# Altium schematic sheet tracker_main.SchDoc
size 431 x 279 mm; SheetNumber: 1; SheetTotal: 2
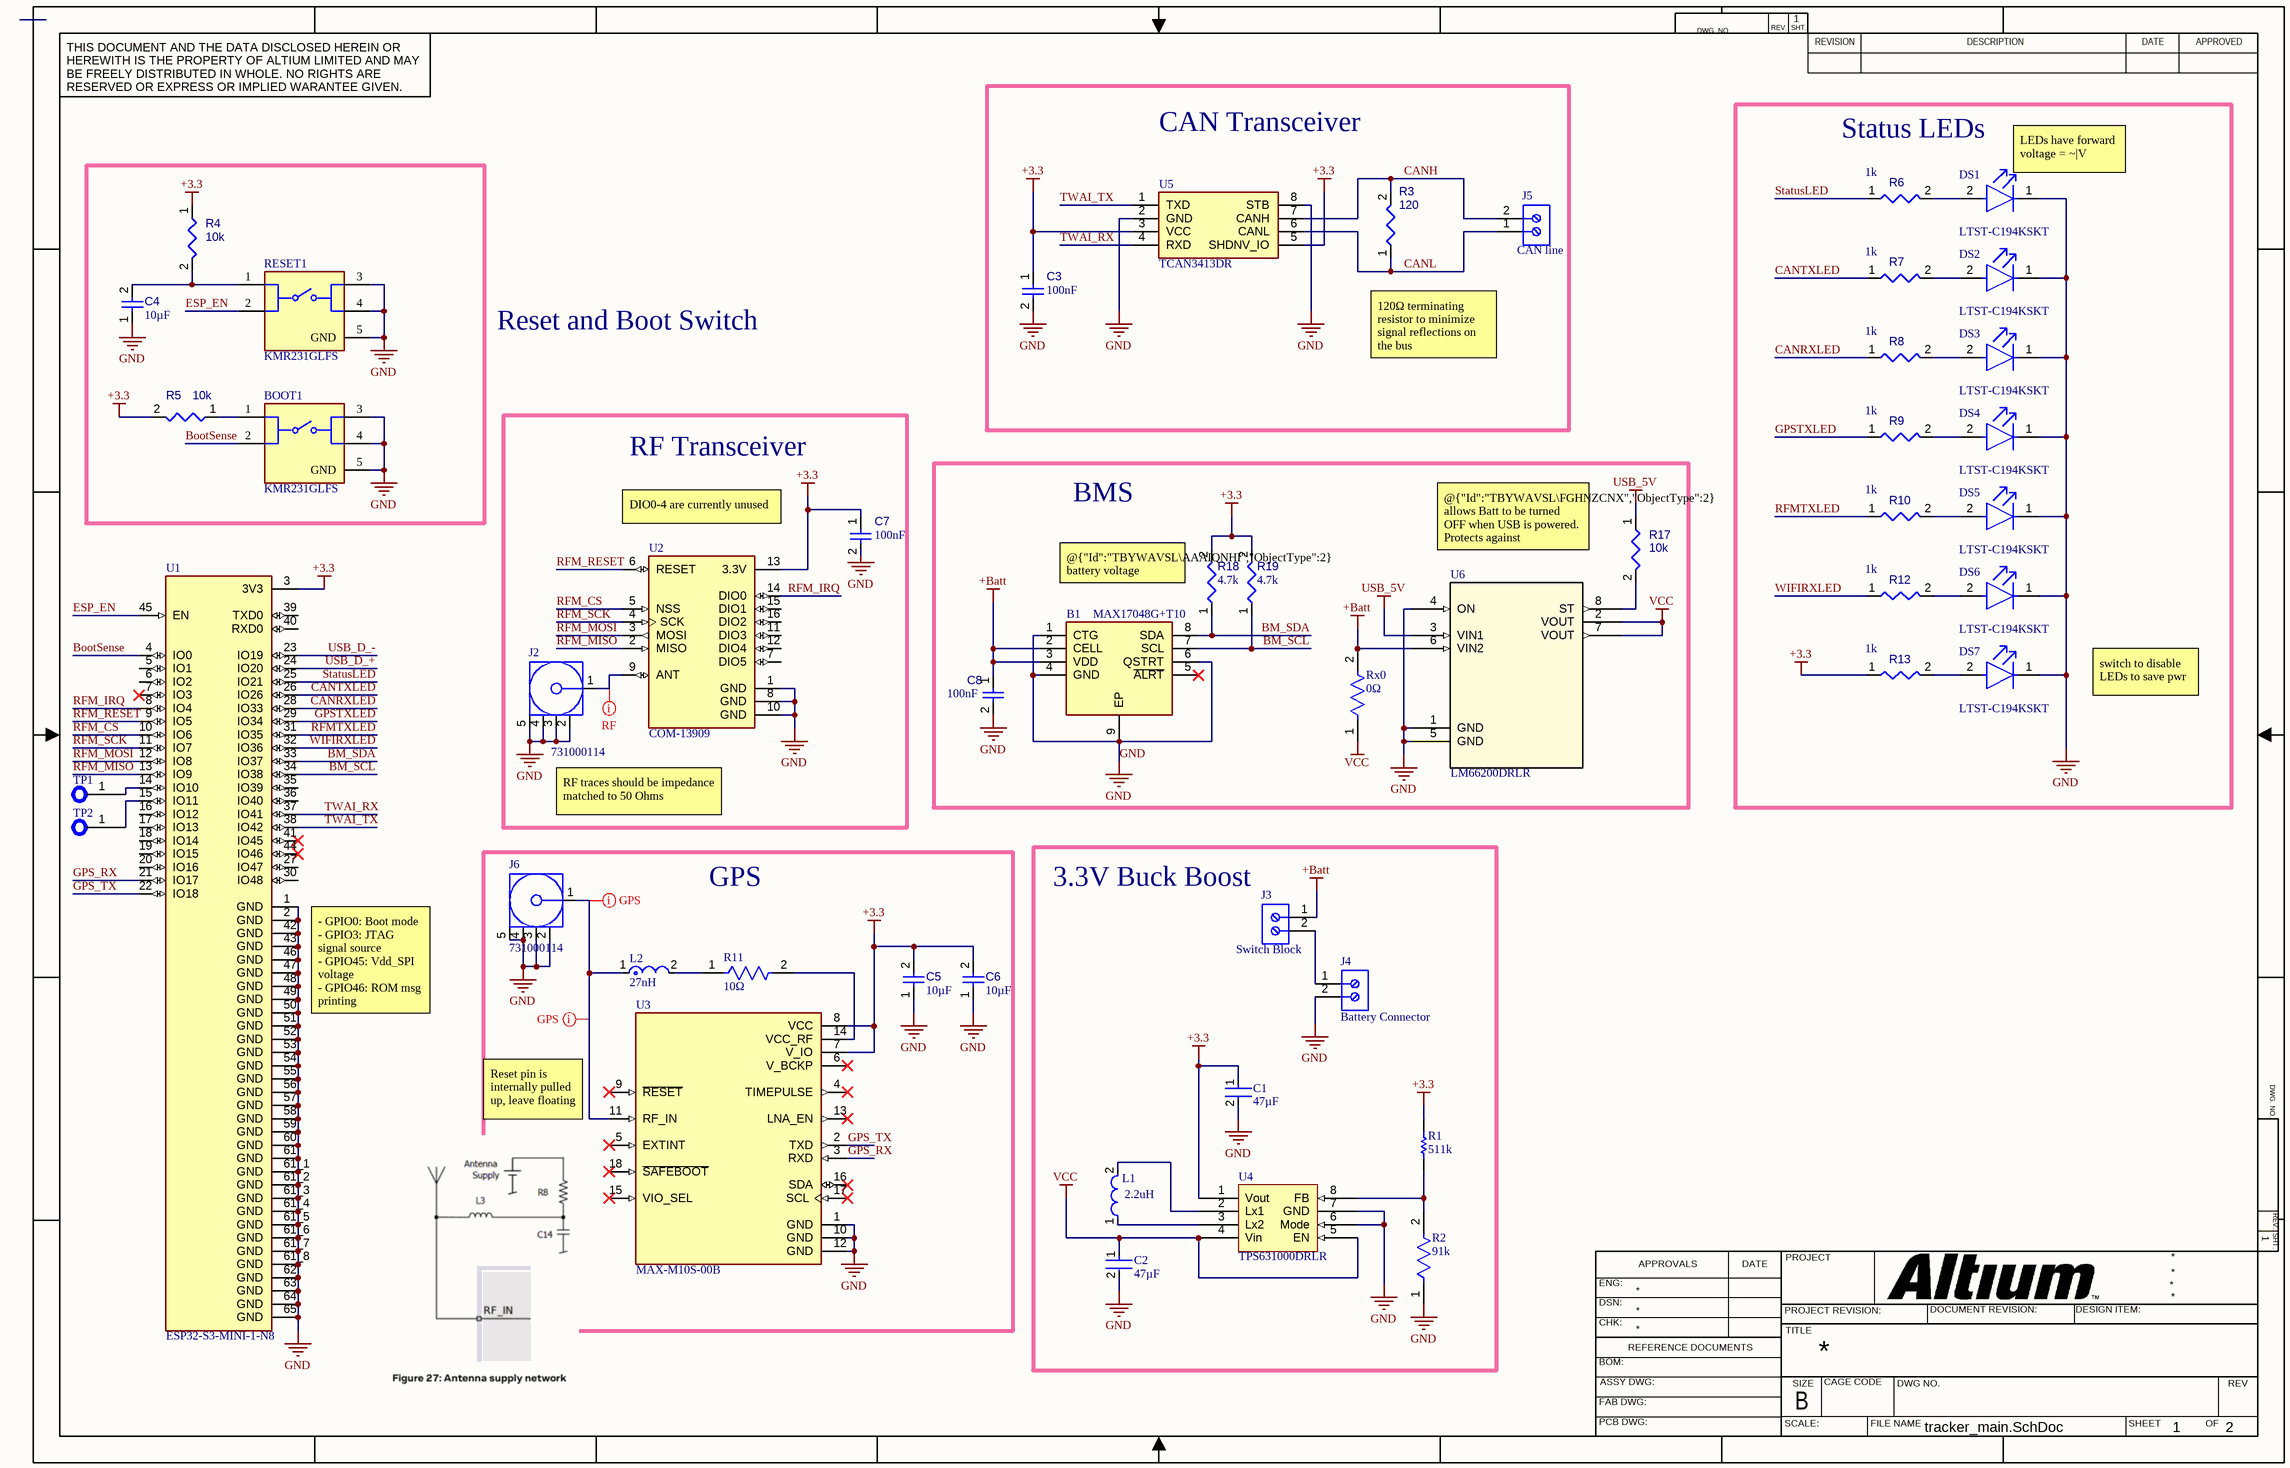
[diagram p0: tracker_main.SchDoc]

## Parts
B1  MAX17048G+T10  [SON50P200X200X80-9N-D]
BOOT1  KMR231GLFS  [FP-KMR231GLFS-MFG]
C1  47µF  [FP-0603-L_1_6_0_2-W_0_8_0-MFG]
C2  47µF  [FP-0603-L_1_6_0_2-W_0_8_0-MFG]
C3  100nF  [CAPC1608X90X40NL10T20]
C4  value 10µF  [CAPC0603(1608)100_L]  (hidden comment: Capacitor 10µF +/-20% 10V 0603)
C5  value 10µF  [CAPC0603(1608)100_L]  (hidden comment: Capacitor 10µF +/-20% 10V 0603)
C6  value 10µF  [CAPC0603(1608)100_L]  (hidden comment: Capacitor 10µF +/-20% 10V 0603)
C7  100nF  [CAPC1608X90X40NL10T20]
C8  100nF  [CAPC1608X90X40NL10T20]
DS1  LTST-C194KSKT  [FP-LTST-C194KSKT-MFG]
DS2  LTST-C194KSKT  [FP-LTST-C194KSKT-MFG]
DS3  LTST-C194KSKT  [FP-LTST-C194KSKT-MFG]
DS4  LTST-C194KSKT  [FP-LTST-C194KSKT-MFG]
DS5  LTST-C194KSKT  [FP-LTST-C194KSKT-MFG]
DS6  LTST-C194KSKT  [FP-LTST-C194KSKT-MFG]
DS7  LTST-C194KSKT  [FP-LTST-C194KSKT-MFG]
J2  731000114  [MOLX-731000114_V]
J3  Switch Block  [PHOE-1725656-2]
J4  Battery Connector  [PHOE-1725656-2]
J5  CAN line  [PHOE-1725656-2]
J6  731000114  [MOLX-731000114_V]
L1  value 2.2uH  [FP-DFE21CC_EL-MFG]  (hidden comment: DFE21CCN2R2MELL)
L2  27nH  [FP-LQG18HH_00-IPC_C]
R1  511k  [RESC1609X50X30NL10T20]
R2  91k  [FP-CRCW0603-HPe3-IPC_B]
R3  120  [RESC0603(1608)_L]
R4  10k  [RESC1608X55X25ML10T15]
R5  10k  [RESC1608X55X25ML10T15]
R6  value 1k  [RESC1608X55X25ML10T15]  (hidden comment: Resistor 1k +/-1% 0603 100 mW)
R7  value 1k  [RESC1608X55X25ML10T15]  (hidden comment: Resistor 1k +/-1% 0603 100 mW)
R8  value 1k  [RESC1608X55X25ML10T15]  (hidden comment: Resistor 1k +/-1% 0603 100 mW)
R9  value 1k  [RESC1608X55X25ML10T15]  (hidden comment: Resistor 1k +/-1% 0603 100 mW)
R10  value 1k  [RESC1608X55X25ML10T15]  (hidden comment: Resistor 1k +/-1% 0603 100 mW)
R11  10Ω  [FP-RNCF0603-MFG]
R12  value 1k  [RESC1608X55X25ML10T15]  (hidden comment: Resistor 1k +/-1% 0603 100 mW)
R13  value 1k  [RESC1608X55X25ML10T15]  (hidden comment: Resistor 1k +/-1% 0603 100 mW)
R17  10k  [RESC1608X55X25ML10T15]
R18  value 4.7k  [RESC1608X55X25ML10T15]  (hidden comment: Resistor 4k7 +/-1% 0603 100 mW)
R19  value 4.7k  [RESC1608X55X25ML10T15]  (hidden comment: Resistor 4k7 +/-1% 0603 100 mW)
RESET1  KMR231GLFS  [FP-KMR231GLFS-MFG]
Rx0  0Ω  [FP-HCJ0805-MFG]
TP1  TP_1  [Testpoint1]  (value not drawn)  (no BOM)
TP2  TP_1  [Testpoint1]  (value not drawn)  (no BOM)
U1  ESP32-S3-MINI-1-N8  [XCVR_ESP32-S3-MINI-1-N8]
U2  COM-13909  [MOD_COM-13909]
U3  MAX-M10S-00B  [XCVR_MAX-M10S-00B]
U4  TPS631000DRLR  [SON50P120X60-8N]
U5  TCAN3413DR  [SOIC127P600X175-8N]
U6  LM66200DRLR  [SOT-5X3_DRL_TEX]

## Blocks framed on the sheet
CAN Transceiver: C3 J5 R3 U5
Status LEDs: DS1-DS7 R6-R10 R12 R13
RF Transceiver: C7 J2 U2
BMS: B1 C8 R17-R19 Rx0 U6
GPS: C5 C6 J6 L2 R11 U3
3.3V Buck Boost: C1 C2 J3 J4 L1 R1 R2 U4

## Nets
+3.3: C1.1 C3.1 C5.2 C6.2 C7.1 R1.2 R4.1 R5.2 R13.1 R18.2 R19.2 U1.3(3V3) U2.13(3.3V) U3.7(V_IO) U3.8(VCC) U4.1(Vout) U5.3(VCC) U5.5(SHDNV_IO)
+Batt: B1.2(CELL) B1.3(VDD) C8.1 J3.1 Rx0.2 U6.6(VIN2)
GND: B1.1(CTG) B1.4(GND) B1.6(QSTRT) B1.9(EP) BOOT1.3 BOOT1.4 BOOT1.5(GND) C1.2 C2.2 C3.2 C4.1 C5.1 C6.1 C7.2 C8.2 DS1.1(C) DS2.1(C) DS3.1(C) DS4.1(C) DS5.1(C) DS6.1(C) DS7.1(C) J2.2 J2.3 J2.4 J2.5 J4.2 J6.2 J6.3 J6.4 J6.5 R2.1 RESET1.3 RESET1.4 RESET1.5(GND) U1.1(GND) U1.2(GND) U1.42(GND) U1.43(GND) U1.46(GND) U1.47(GND) U1.48(GND) U1.49(GND) U1.50(GND) U1.51(GND) U1.52(GND) U1.53(GND) U1.54(GND) U1.55(GND) U1.56(GND) U1.57(GND) U1.58(GND) U1.59(GND) U1.60(GND) U1.61(GND) U1.61_1(GND) U1.61_2(GND) U1.61_3(GND) U1.61_4(GND) U1.61_5(GND) U1.61_6(GND) U1.61_7(GND) U1.61_8(GND) U1.62(GND) U1.63(GND) U1.64(GND) U1.65(GND) U2.1(GND) U2.8(GND) U2.10(GND) U3.1(GND) U3.10(GND) U3.12(GND) U4.6(Mode) U4.7(GND) U5.2(GND) U5.8(STB) U6.1(GND) U6.4(ON) U6.5(GND)
USB_5V: R17.1 U6.3(VIN1)
VCC: C2.1 Rx0.1 U4.4(Vin) U4.5(EN) U6.2(VOUT) U6.7(VOUT)
BM_SCL: B1.7(SCL) R19.1 U1.34(IO38)
BM_SDA: B1.8(SDA) R18.1 U1.33(IO37)
BootSense: BOOT1.2 U1.4(IO0)
CANH: J5.2 R3.2 U5.7(CANH)
CANL: J5.1 R3.1 U5.6(CANL)
CANRXLED: R8.1 U1.28(IO33)
CANTXLED: R7.1 U1.26(IO26)
ESP_EN: RESET1.2 U1.45(EN)
GPS_RX: U1.21(IO17) U3.3(RXD)
GPS_TX: U1.22(IO18) U3.2(TXD)
GPSTXLED: R9.1 U1.29(IO34)
RFM_CS: U1.10(IO6) U2.5(NSS)
RFM_IRQ: U1.8(IO4) U2.14(DIO0)
RFM_MISO: U1.13(IO9) U2.2(MISO)
RFM_MOSI: U1.12(IO8) U2.3(MOSI)
RFM_RESET: U1.9(IO5) U2.6(RESET)
RFM_SCK: U1.11(IO7) U2.4(SCK)
RFMTXLED: R10.1 U1.31(IO35)
StatusLED: R6.1 U1.25(IO21)
TWAI_RX: U1.37(IO41) U5.4(RXD)
TWAI_TX: U1.38(IO42) U5.1(TXD)
USB_D_+: U1.24(IO20)
USB_D_-: U1.23(IO19)
WIFIRXLED: R12.1 U1.32(IO36)
NetBOOT1_1: BOOT1.1 R5.1
NetC4_2: C4.2 R4.2 RESET1.1
NetDS1_2: DS1.2(A) R6.2
NetDS2_2: DS2.2(A) R7.2
NetDS3_2: DS3.2(A) R8.2
NetDS4_2: DS4.2(A) R9.2
NetDS5_2: DS5.2(A) R10.2
NetDS6_2: DS6.2(A) R12.2
NetDS7_2: DS7.2(A) R13.2
NetJ2_1: J2.1 U2.9(ANT)
NetJ3_2: J3.2 J4.1
NetJ6_1: J6.1 L2.1 U3.11(RF_IN)
NetL1_1: L1.1 U4.3(Lx2)
NetL1_2: L1.2 U4.2(Lx1)
NetL2_2: L2.2 R11.1
NetR1_1: R1.1 R2.2 U4.8(FB)
NetR11_2: R11.2 U3.14(VCC_RF)
NetR17_2: R17.2 U6.8(ST)
NetTP1_1: TP1.1 U1.14(IO10)
NetTP2_1: TP2.1 U1.15(IO11)

Not connected (* = marked no-connect by the designer): B1 5(~{ALRT})*; U1 5(IO1) 6(IO2) 7(IO3)* 16(IO12) 17(IO13) 18(IO14) 19(IO15) 20(IO16) 27(IO47) 30(IO48) 35(IO39) 36(IO40) 39(TXD0) 40(RXD0) 41(IO45)* 44(IO46)*; U2 7(DIO5) 11(DIO3) 12(DIO4) 15(DIO1) 16(DIO2); U3 4(TIMEPULSE)* 5(EXTINT)* 6(V_BCKP)* 9(~{RESET})* 13(LNA_EN)* 15(VIO_SEL)* 16(SDA)* 17(SCL)* 18(~{SAFEBOOT})*

## Layout directives
net class RF: NetJ2_1
net class GPS: NetJ6_1

## Notes on the sheet
- (near DS1) LEDs have forward voltage = ~2V
- Reset and Boot Switch
- 120Ω terminating resistor to minimize signal reflections on the bus
- (near U2) DIO0-4 are currently unused
- @{"Id":"TBYWAVSL\FGHNZCNX","ObjectType":2} allows Batt to be turned OFF when USB is powered. Protects against overcharging li-ion cell
- (near R18) @{"Id":"TBYWAVSL\AAAIQNHI","ObjectType":2} battery voltage monitoring IC
- switch to disable LEDs to save pwr
- RF traces should be impedance matched to 50 Ohms
- (near U1) - GPIO0: Boot mode
  - GPIO3: JTAG signal source
  - GPIO45: Vdd_SPI voltage
  - GPIO46: ROM msg printing
- Reset pin is internally pulled up, leave floating
- DWG. NO.
- REV.
- SHT.
- THIS DOCUMENT AND THE DATA DISCLOSED HEREIN OR HEREWITH IS THE PROPERTY OF ALTIUM LIMITED AND MAY BE FREELY DISTRIBUTED IN WHOLE. NO RIGHTS ARE RESERVED OR EXPRESS OR IMPLIED WARANTEE GIVEN.
- REVISION
- DESCRIPTION
- DATE
- APPROVED
- ENG:
- APPROVALS
- PROJECT
- DSN:
- CHK:
- REFERENCE DOCUMENTS
- PROJECT REVISION:
- TITLE
- DOCUMENT REVISION:
- DESIGN ITEM:
- BOM:
- FAB DWG:
- PCB DWG:
- ASSY DWG:
- SCALE:
- SIZE
- B
- CAGE CODE
- FILE NAME
- DWG NO.
- SHEET
- OF
- REV

## Library data of the parts
B1 = CMP-013-000000-1: 3A 1-Cell/2-Cell Fuel Gauge with ModelGauge; Manufacturer_Name: Analog Devices; Geometry.Height: 0.8mm; Manufacturer_Part_Number: MAX17048G+T10; Source: MAX17048G+T10.SchLib; Mouser Part Number: 700-MAX17048G+T10; Design Item ID: MAX17048G+T10; Datasheet Link: https://www.analog.com/MAX17048/datasheet; Mouser Price/Stock: https://www.mouser.co.uk/ProductDetail/Analog-Devices-Maxim-Integrated/MAX17048G%2bT10?qs=D7PJwyCwLAoGnnn8jEPRBQ%3D%3D; Arrow Part Number: MAX17048G+T10; Arrow Price/Stock: https://www.arrow.com/en/products/max17048gt10/analog-devices?utm_currency=USD&region=nac
BOOT1 RESET1 = CMP-2000-06516-3: SWITCH TACTILE SPST-NO 0.05A 32V; Switch Travel: 0.25mm; Current Rating: 50mA; Operating Force: 3N; Actuator Type: Standard; Illumination Type: Non-Illuminated; Mechanical Life: 150000Cycles; Insulation Resistance: 1GR; Contact Resistance: 100mR; Actuator Length: 0.5mm; Power Rating: 1W; Throw Configuration: SPST; Switch Function: Off-Mom; Min Operating Temperature: -40°C; Termination: Gull Wing; Orientation: Straight; Lead Free: Lead Free; Width: 2.8mm; Contact Material: Silver; Max Voltage Rating (DC): 32V; Max Current Rating: 50mA; Contact Plating: Silver; Radiation Hardening: No; Depth: 4.6mm; Mount: Surface Mount; Max Operating Temperature: 85°C; Case/Package: SMD/SMT; Contact Current Rating: 50mA; Length: 4.6mm; Package Quantity: 7000; Series: KMR2; REACH SVHC: No SVHC; Packaging: Cut Tape; Voltage Rating (DC): 32V
C1 C2 = CMP-04427-000093-1: CAP CER 47UF 6.3V X5R 0603 / 06036D476MAT2A; Tolerance: 20%; Case/Package: 0603; Case Code (Imperial): 0603; RoHS Compliant: Yes; Packaging: Tape and Reel; Max Operating Temperature: 85°C; Voltage Rating: 6.3V; Mount: Surface Mount; Min Operating Temperature: -55°C; Capacitance: 47uF; Case Code (Metric): 1608
C3 C7 C8 = CMP-001-00017-6: Chip Capacitor, 100 nF, +/- 10%, 50 V, 0603 (1608 Metric); Voltage Rating: 50V; Capacitor Type: Ceramic; Tolerance: 10%; Mounting Technology: SM; Value: 100nF; Max Operating Temperature: 125°C; RoHS Compliant: True; Pins: 2; Case/Package: 0603; Min Operating Temperature: -55°C
C4-C6 = CMP-001-00075-4: Chip Capacitor, 10µF +/-20%, 10V, 0603, Thickness 1 mm; Tolerance: 10%; Voltage Rating: 10V; Max Operating Temperature: 85°C; Pins: 2; Case/Package: 0603; Mounting Technology: SMT; Min Operating Temperature: -55°C
DS1-DS7 = CMP-007-00037-1: Single Color LED, Yellow, Water Clear, 1.15mm; Forward Voltage: 2V; Forward Current: 30mA; Mounting Technology: Surface Mount; Case/Package: 0603; Pins: 2; Min Operating Temperature: -55°C; Max Operating Temperature: 85°C
J2 J6 = CMP-2000-05487-1: SMA Right-Angle PCB Jack Receptacle, Brass Body, Gold Plated, 50 Ohm, 5-Pin THD, RoHS, Tray; Manufacturer: Molex; Datasheet Version: 09/2016; Package Description: 5-Pin Through Hole Device, Body 14.8 x 6.35 mm, Pitch 2.54 mm; Datasheet URL: http://www.molex.com/webdocs/datasheets/pdf/en-us/0731000114_RF_COAX_CONNECTORS.pdf; Manufacturer URL: http://www.molex.com/; Package Reference: 731000114; Mounting Technology: ThroughHole; Package URL: http://www.molex.com/pdm_docs/sd/731000114_sd.pdf
J3-J5 = CMP-2000-05299-1: Male Header, Pitch 2.54 mm, 1 x 2 Position, Height 9 mm, Tail Length 3.5 mm; Manufacturer part No.: 1725656; Manufacturer: Phoenix Contact; Number of contacts: 2; Content: 250pc(s); Pitch: 2.54mm; Industrial packaging: Yes; Colour: Green; Type: MPT0,5/2-2,54; Datasheet URL: http://datasheet.octopart.com/1725656-Phoenix-Contact-datasheet-5302866.pdf; Manufacturer URL: http://www.phoenixcontact.com/; Datasheet Version: Apr-08
L1 = CMP-06042-017091-1: FIXED IND 2.2UH 2100MA NONAUTO
L2 = CMP-06042-012021-1: Multilayer type Inductor for Automotive 27nH ±5% 0.54Ω 500mA 0603 LQG18HH27NJ00D; DC Resistance (DCR): 4.18mR; Packaging: Tape and Reel; Case/Package: 0603; Package Quantity: 4000; Inductance: 27nH; Termination: SMD/SMT
R1 = CMP-2000-03441-1: CRCW0603511KFKEA / Res Thick Film 0603 511K Ohm 1% 0.1W(1/10W) ±100ppm/C Pad SMD Automotive T/R; Manufacturer: Vishay Dale; Part Number: CRCW0603511KFKEA
R2 = CMP-02407-006578-1: CRCW060391K0FKEAHP / RES Thick Film, 91kΩ, 1%, 0.33W, 100ppm/°C, 0603; Power Rating: 250mW; Resistance: 91kR; Mount: Surface Mount; Features: Automotive AEC-Q200; Length: 0.063inch; Composition: Thick Film; Max Operating Temperature: 155°C; Number of Terminations: 2; Temperature Coefficient: 100ppm/°C; Package Quantity: 5000; Tolerance: 1%; Width: 0.033inch; Packaging: Tape and Reel; Termination: Wraparound; Height: 0.022inch; Contact Plating: Tin; Min Operating Temperature: -55°C; Lead Free: Lead Free; Max Power Dissipation: 250mW; Case/Package: 0603
R3 = CMP-009-00176-3: Chip Resistor, 120 Ohms, +/-5 %, 0.1 W, -55 to 155 degC, 0603; Tolerance: 5%; Power: 100mW; Value: 120; Max Operating Temperature: 155°C; Pins: 2; Case/Package: 0603; Min Operating Temperature: -55°C
R4 R5 R17 = CMP-009-00017-5: Chip Resistor, 10 KOhm, +/- 1%, 01 W, -55 to 155 degC, 0603 (1608 Metric); Power: 100mW; Voltage Rating: 50V; Value: 10k; Tolerance: 1%; RoHS Compliant: True; Min Operating Temperature: -55°C; Pins: 2; Case/Package: 0603; Mounting Technology: SM; Max Operating Temperature: 155°C
R6-R10 R12 R13 = CMP-009-00014-5: Chip Resistor, 1 KOhm, +/-1%, 0.1 W, -55 to 155 degC, 0603 (1608 Metric); Tolerance: 1%; Power: 100mW; Voltage Rating: 50V; RoHS Compliant: True; Min Operating Temperature: -55°C; Max Operating Temperature: 155°C; Case/Package: 0603; Mounting Technology: SM; Pins: 2
R11 = CMP-26527-002750-1: RES 10 OHM 0.05% 1/10W 0603 RNCF0603AKT10R0; Temperature Coefficient: 10ppm/°C; Max Power Dissipation: 100mW; Resistance: 10R; RoHS Compliant: Yes; Case/Package: 0603; Width: 0.031inch; Min Operating Temperature: -55°C; Features: Moisture Resistant; Tolerance: 0.05%; Case Code (Imperial): 0603; Mount: Surface Mount; Resistor Type: Thin Film; Length: 0.063inch; Height: 0.022inch; Case Code (Metric): 1608; Number of Terminations: 2; Max Operating Temperature: 155°C; Packaging: Tape and Reel
R18 R19 = CMP-009-00031-5: Chip Resistor, 4.7 KOhm, +/- 1%, 0.1 W, -55 to 155 degC, 0603 (1608 Metric); Power: 100mW; Tolerance: 1%; Mounting Technology: SM; Case/Package: 0603; RoHS Compliant: True; Pins: 2; Min Operating Temperature: -55°C; Max Operating Temperature: 155°C
Rx0 = CMP-26527-000104-1: RES 0 OHM JUMPER 1/2W 0805; Resistance: 0mR; Radiation Hardening: No; Case Code (Imperial): 0805; Number of Terminations: 2; Lead Free: Lead Free; Max Operating Temperature: 155°C; Width: 0.049inch; Case Code (Metric): 2012; Height: 0.026inch; Mount: Surface Mount; Min Operating Temperature: -55°C; Packaging: Tape and Reel; Package Quantity: 1; Termination: Wraparound; Length: 0.079inch; RoHS Compliant: Yes; Case/Package: 0805
TP1 TP2 = Testpoint1
U1 = CMP-003-000000-2: SMD module, ESP32-S3FN8, 8 MB SPI flash, PCB antenna; MF: {'manufacturer': u'Espressif Systems'}; Availability: Unavailable; Price: None; Package: None; Pin Count: 73; Source: ESP32-S3-MINI-1-N8.SchLib; Component Type: Standard; Value: *; RoHS: Compliant; MP: ESP32-S3-MINI-1-N8; Design Item ID: ESP32-S3-MINI-1-N8
U2 = CMP-00025-00003-3: Rfm69hcw Wireless Transceiver 91; Component Type: Standard; Design Item ID: COM-13909; Source: COM-13909.SchLib; Value: *; Pins: 16; Price: None; MP: COM-13909; Availability: Unavailable; Case/Package: None
U3 = CMP-007-000000-1: Gnss / Gps Modules U-Blox M10 Gnss Module Rom, Tcxo, Lna, Saw Lcc, 9.7X10 Mm, 500 Pcs/Reel; Value: *; Package: None; Design Item ID: MAX-M10S-00B; Availability: Unavailable; Component Type: Standard; Price: None; MP: MAX-M10S-00B; Pin Count: 18; Source: MAX-M10S-00B.SchLib
U4 = CMP-019-00050-1: 1.5-A output current, high-power-density buck-boost converter 8-SOT-5X3 -40 to 125
U5 = TCAN3413DR: Integrated Circuit; Manufacturer_Name: Texas Instruments; Datasheet Link: https://www.ti.com/lit/ds/symlink/tcan3413.pdf?ts=1704463166829&ref_url=https%253A%252F%252Fwww.ti.com%252Fproduct%252Fde-de%252FTCAN3413; Height: 1.75mm; Manufacturer_Part_Number: TCAN3413DR; Mouser Part Number: 595-TCAN3413DR; Mouser Price/Stock: https://www.mouser.co.uk/ProductDetail/Texas-Instruments/TCAN3413DR?qs=mELouGlnn3eIMT2B6sccyw%3D%3D; Arrow Part Number: TCAN3413DR; Arrow Price/Stock: https://www.arrow.com/en/products/tcan3413dr/texas-instruments?utm_currency=USD&region=nac
U6 = CMP-004-00031-1: 1.6-V to 5.5-V, 40-mâ„; Manufacturer_Name: Texas Instruments; Type: Type; Source: LM66200DRLR.SchLib; Design Item ID: LM66200DRLR; RefDes: RefDes; Manufacturer_Part_Number: LM66200DRLR; Copyright: Copyright (C) 2025 Ultra Librarian. All rights reserved.